# EAGLE design BD3721X_DUAL (EAGLE 8.7.0)
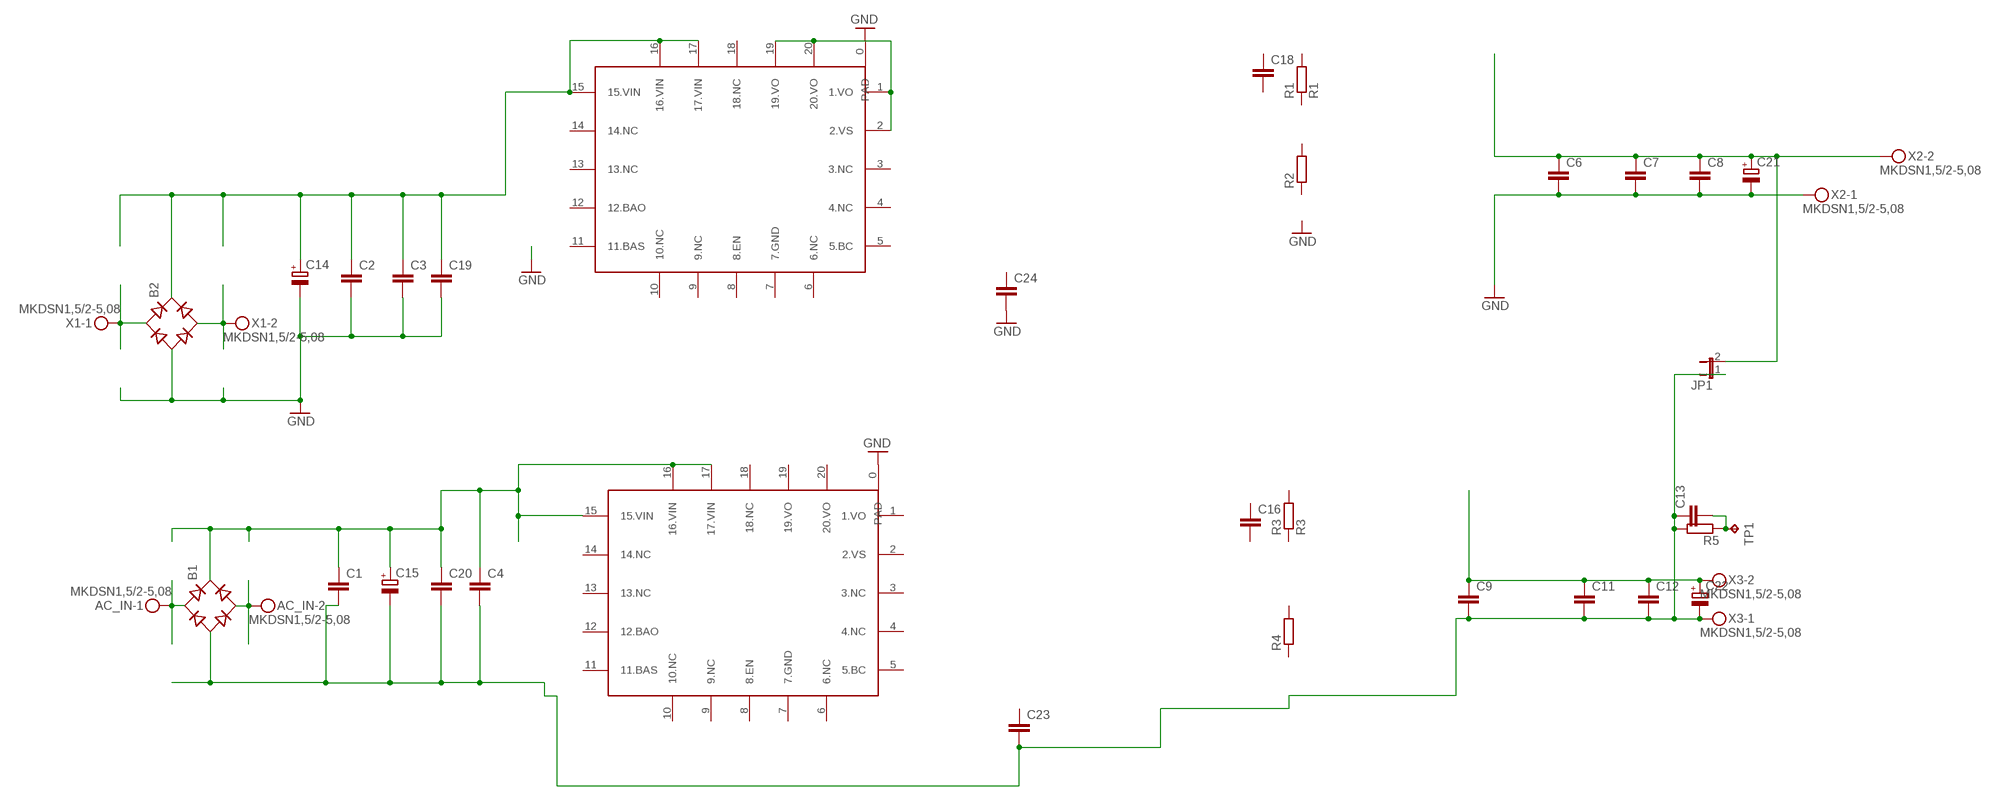
[diagram p0: schematic, sheet 1]

## Parts
AC_IN  MKDSN1,5/2-5,08  [MKDSN1,5/2-5,08]
B1  RB1A  [RB1A]
B2  RB1A  [RB1A]
C1  C-EUC1210  [C1210]
C2  C-EUC1210  [C1210]
C3  C-EUC0805  [C0805]
C4  C-EUC0805  [C0805]
C6  C-EUC0603  [C0603]
C7  C-EUC0805  [C0805]
C8  C-EUC1210  [C1210]
C9  C-EUC0603  [C0603]
C11  C-EUC1210  [C1210]
C12  C-EUC0805  [C0805]
C13  C-EU075-042X103  [C075-042X103]
C14  CPOL-EUE5-13  [E5-13]
C15  CPOL-EUE5-13  [E5-13]
C16  C-EUC0603  [C0603]
C18  C-EUC0603  [C0603]
C19  C-EUC0603  [C0603]
C20  C-EUC0603  [C0603]
C21  CPOL-EUE3.5-8  [E3,5-8]
C22  CPOL-EUE3.5-8  [E3,5-8]
C23  C-EUC0603  [C0603]
C24  C-EUC0603  [C0603]
JP1  JP1E  [JP1]
R1  R1  R-EU_R0805  [R0805]
R2  R-EU_R0805  [R0805]
R3  R3  R-EU_R0805  [R0805]
R4  R-EU_R0805  [R0805]
R5  R-EU_0207/12  [0207/12]
TP1  TPPAD1-13  [P1-13]
U$1  BD37210QFN20  [QFN20-4X4MM]
U$2  BD37210QFN20  [QFN20-4X4MM]
X1  MKDSN1,5/2-5,08  [MKDSN1,5/2-5,08]
X2  MKDSN1,5/2-5,08  [MKDSN1,5/2-5,08]
X3  MKDSN1,5/2-5,08  [MKDSN1,5/2-5,08]

## Nets
GND: B2.- C2.2 C3.2 C6.2 C7.2 C8.2 C14.- C19.2 C21.- C24.2 U$1.0(PAD) U$2.0(PAD) X2.1
GND2: B1.- C1.2 C4.2 C9.2 C11.2 C12.2 C13.1 C15.- C20.2 C22.- C23.2 JP1.1 R5.2 X3.1
N$2: AC_IN.1 B1.AC1
N$3: B2.+ C2.1 C3.1 C14.+ C19.1 U$1.15(15.VIN) U$1.16(16.VIN) U$1.17(17.VIN)
N$5: U$1.1(1.VO) U$1.2(2.VS) U$1.19(19.VO) U$1.20(20.VO)
N$9: B2.AC2 X1.2
N$10: B2.AC1 X1.1
N$12: AC_IN.2 B1.AC2
N$13: C13.2 R5.1 TP1.TP
N$15: B1.+ C1.1 C4.1 C15.+ C20.1 U$2.15(15.VIN) U$2.16(16.VIN) U$2.17(17.VIN)
V+: C6.1 C7.1 C8.1 C21.+ JP1.2 X2.2
V-: C9.1 C11.1 C12.1 C22.+ X3.2
Unconnected: C16.1 C16.2 C18.1 C18.2 C23.1 C24.1 R1.1 R1.2 R2.1 R2.2 R3.1 R3.2 R4.1 R4.2 U$1.3(3.NC) U$1.4(4.NC) U$1.5(5.BC) U$1.6(6.NC) U$1.7(7.GND) U$1.8(8.EN) U$1.9(9.NC) U$1.10(10.NC) U$1.11(11.BAS) U$1.12(12.BAO) U$1.13(13.NC) U$1.14(14.NC) U$1.18(18.NC) U$2.1(1.VO) U$2.2(2.VS) U$2.3(3.NC) U$2.4(4.NC) U$2.5(5.BC) U$2.6(6.NC) U$2.7(7.GND) U$2.8(8.EN) U$2.9(9.NC) U$2.10(10.NC) U$2.11(11.BAS) U$2.12(12.BAO) U$2.13(13.NC) U$2.14(14.NC) U$2.18(18.NC) U$2.19(19.VO) U$2.20(20.VO)

## Library data of the parts
AC_IN X1-X3 = con-phoenix-508:MKDSN1,5/2-5,08: MKDSN 1,5/ 2-5,08 Printklemme Nennstrom: 13,5 A Nennspannung: 250 V Rastermaß: 5,08 mm Polzahl: 2 Anschlussart: Schraubanschluss Montage: Löten Anschlussrichtung Leiter/Platine: 0 ° Artikelnummer: 1729128 Source: http://eshop.phoenixcontact.com .. 1729128.pdf
B1 B2 = rectifier:RB1A: RECTIFIER 1 A
C1-C4 C6-C9 C11-C13 C16 C18-C20 C23 C24 = Vwvwbg:C-EU: CAPACITOR, European symbol
C14 C15 C21 C22 = Vwvwbg:CPOL-EU: POLARIZED CAPACITOR, European symbol
JP1 = jumper:JP1E: JUMPER
R1-R5 = Vwvwbg:R-EU_: RESISTOR, European symbol
TP1 = testpad:TP: Test pad
U$1 U$2 = Vwvwbg:BD37210

## Board
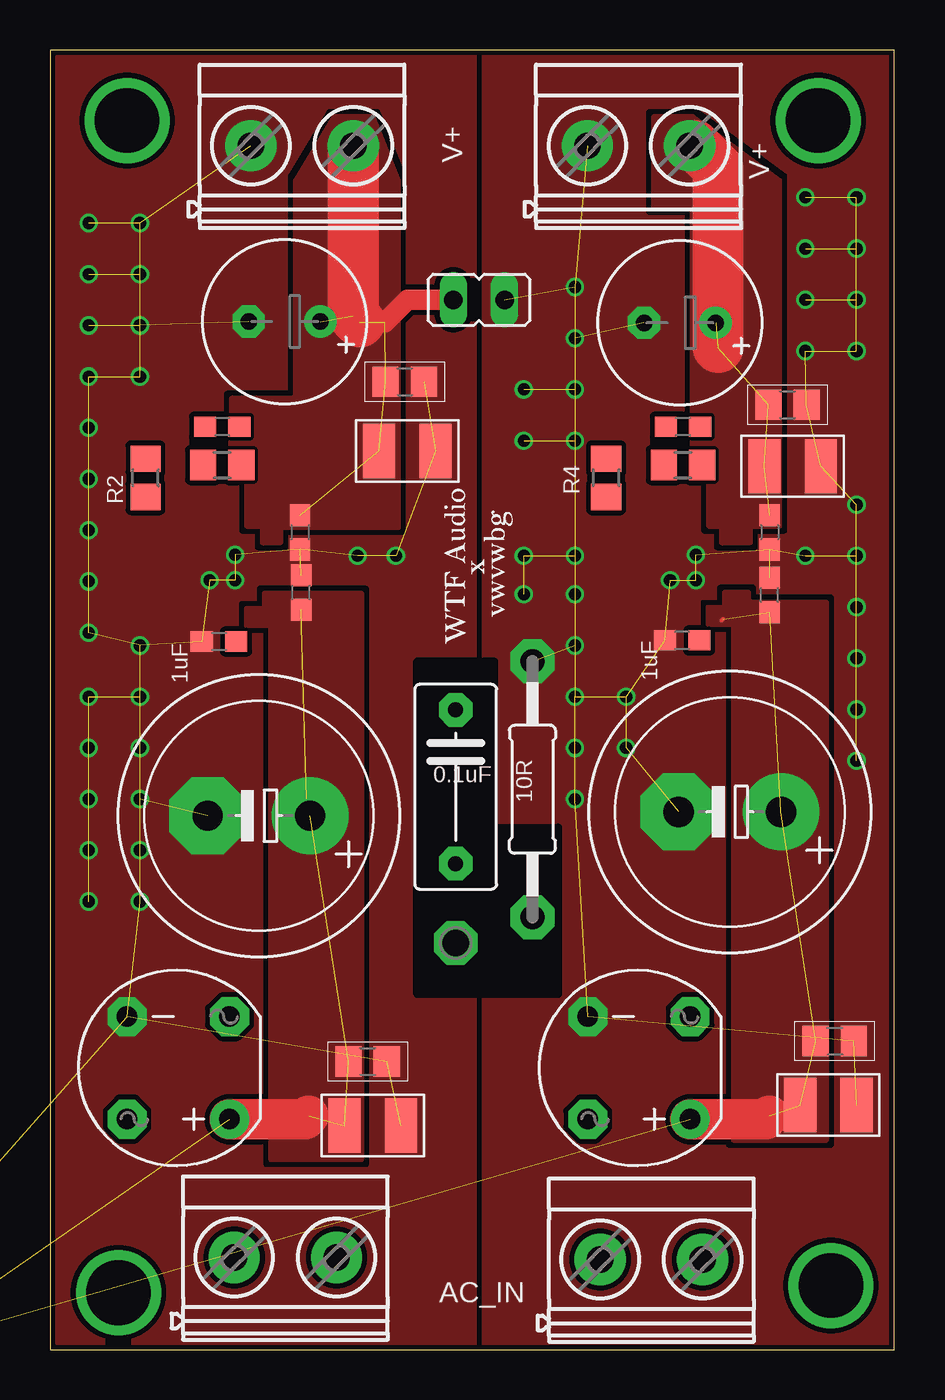
[diagram p1: board, top side]
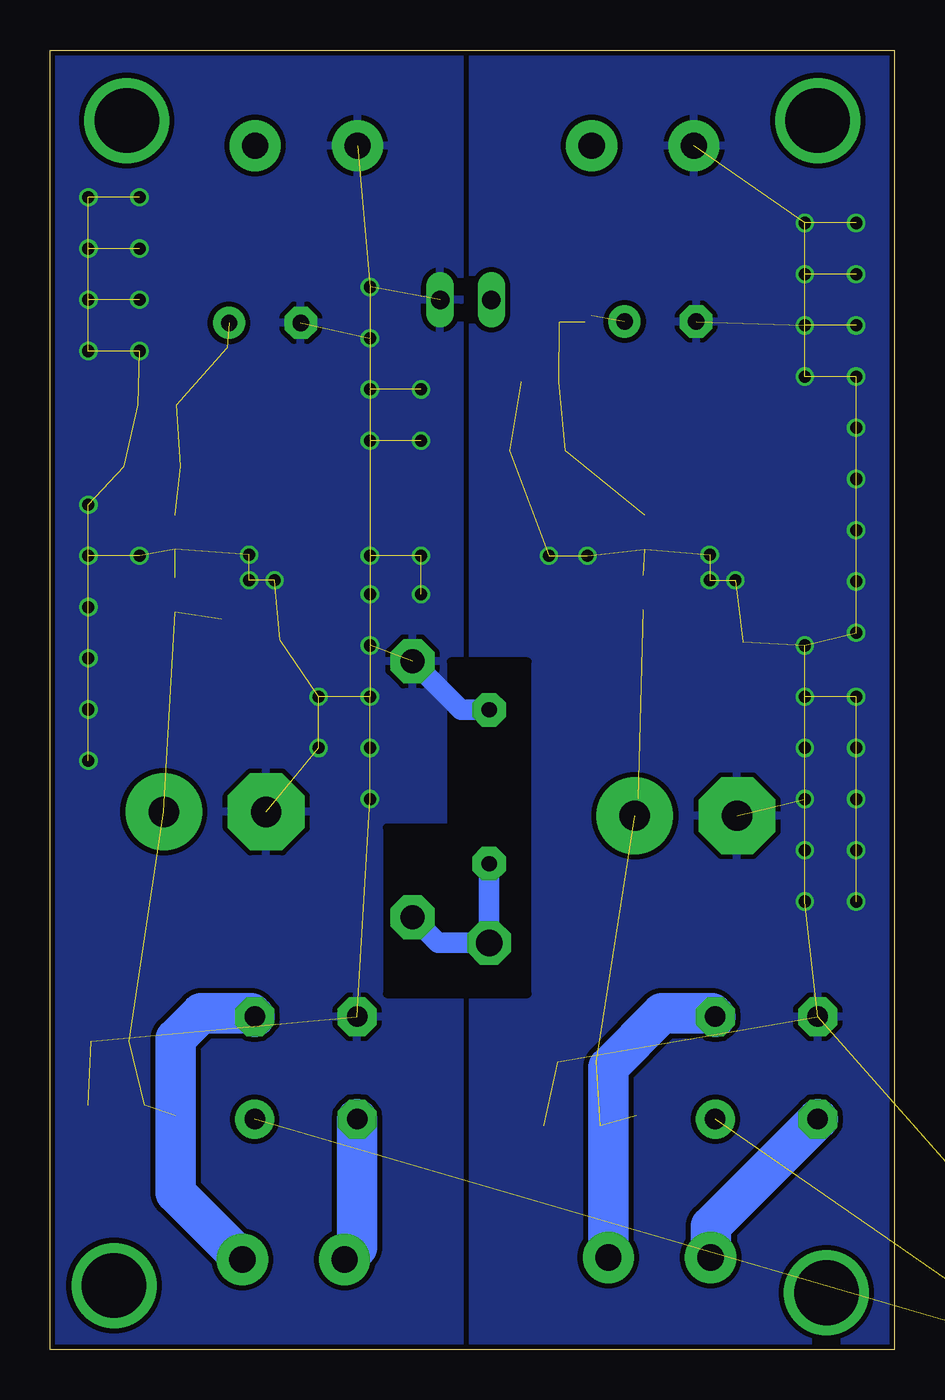
[diagram p2: board, bottom side, seen from below]

Size 41.89 x 64.44 mm. Coordinates in mm from the lower left corner, seen from the top.
Outline: 0,0 41.89,0 41.89,64.44 0,64.44 0,0
Copper layers (1*16): Top 0.035mm / dielectric 1.5mm / Bottom 0.035mm
Design rules "default *": minimum track width 6mil, minimum drill 0.3mm, track to track 7mil, track to pad 7mil, pad to pad 7mil, via to via 7mil, smd to smd 7mil, copper to edge 8mil, drill to drill 8mil, minimum pad ring 6mil, minimum via ring 6mil, stop-mask expansion 4mil, vias tented up to drill 25mil, thermal gap 10mil

### Footprints (pad centres in the part's own frame; a part is rotated, then mirrored left to right if it is on the bottom)
MKDSN1,5/2-5,08 = drill 1.3 pad 2.54: 1 -2.561,0.025; 2 2.519,0.025
RB1A = drill 1.016 pad 1.93: + -2.54,2.54 | drill 1.016 pad 1.93 octagon: - 2.54,-2.54; AC1 2.54,2.54; AC2 -2.54,-2.54
C1210 = smd 1.6 x 2.7: 1 -1.4,0; 2 1.4,0
C0805 = smd 1.3 x 1.5: 1 -0.95,0; 2 0.95,0
C0603 = smd 1.1 x 1: 1 -0.85,0; 2 0.85,0
C075-042X103 = drill 0.75 pad 1.676 octagon: 1 -3.81,0; 2 3.81,0
E5-13 = drill 1.5 pad 3.81: + -2.54,0 | drill 1.5 pad 3.81 octagon: - 2.54,0
E3,5-8 = drill 0.813 pad 1.6: + -1.778,0 | drill 0.813 pad 1.6 octagon: - 1.778,0
JP1 = drill 0.914 long: 1 0,-1.27; 2 0,1.27
R0805 = smd 1.3 x 1.5: 1 -0.95,0; 2 0.95,0
0207/12 = drill 1.2 pad 2.184 octagon: 1 -6.35,0; 2 6.35,0
P1-13 = drill 1.321 pad 2.159 octagon: TP 0,0
QFN20-4X4MM = smd 1 x 1: 0 0,0 | smd 0.65 x 0.3: 1 -1.9,1; 2 -1.9,0.5; 3 -1.9,0; 4 -1.9,-0.5; 5 -1.9,-1; 11 1.9,-1; 12 1.9,-0.5; 13 1.9,0; 14 1.9,0.5; 15 1.9,1 | smd 0.3 x 0.65: 6 -1,-1.9; 7 -0.5,-1.9; 8 0,-1.9; 9 0.5,-1.9; 10 1,-1.9; 16 1,1.9; 17 0.5,1.9; 18 0,1.9; 19 -0.5,1.9; 20 -1,1.9

### Placement (x,y rotation side)
AC_IN  29.84,4.44 0 top
B1  29.21,13.97 180 top
B2  6.35,13.97 180 top
C1  38.61,12.13 0 top
C2  16,11.11 0 top
C3  15.75,14.29 0 top
C4  38.93,15.3 0 top
C6  12.39,40.54 270 top
C7  17.59,48.01 0 top
C8  17.72,44.58 0 top
C9  35.69,40.54 270 top
C11  36.83,43.81 0 top
C12  36.58,46.86 0 top
C13  20.11,27.92 270 top
C14  10.35,26.48 180 top
C15  33.72,26.67 180 top
C16  31.39,45.78 180 top
C18  8.53,45.78 180 top
C19  12.45,37.55 90 top
C20  35.69,37.43 90 top
C21  11.62,50.99 180 top
C22  31.24,50.93 180 top
C23  31.35,35.18 180 top
C24  8.37,35.12 180 top
JP1  21.27,52.07 90 top
R1  8.53,43.87 0 top
R2  4.72,43.24 90 top
R3  31.39,43.87 0 top
R4  27.58,43.24 90 top
R5  23.92,27.79 90 top
TP1  20.11,20.17 0 top
U$1  -15.13,-4.91 0 top  (outside the outline)
U$2  -22.75,-4.91 0 top  (outside the outline)
X1  11.68,4.55 0 top
X2  12.51,59.69 0 top
X3  29.21,59.69 0 top

### Tracks (layer width: path | path; a pad name or v marks a point on that pad's centre or on a via)
GND  (via drill 0.6)  (41 unrouted)
  other vias: 7.9,38.16 9.17,38.16 1.91,38.1 1.91,27.3 1.91,32.38 1.91,29.85 1.91,24.77 17.14,39.37 1.91,40.64 15.24,39.37 1.91,43.18 9.17,39.43 1.91,45.72 1.91,48.26 4.44,48.26 4.44,50.8 1.91,50.8 1.91,53.34 4.44,53.34 4.44,55.88 1.91,55.88 1.91,35.56 1.91,22.23 4.44,22.23 4.44,24.77 4.44,27.3 4.44,29.85 4.44,32.38 4.44,34.92
  pour Top (isolate 0.254, rank 3, no thermals): -1.27,64.77 20.96,64.77 20.96,0 -1.27,0
  pour Bottom (isolate 0.254, rank 3): -1.27,64.77 20.96,64.77 20.96,0 -1.27,0
GND2  (via drill 0.6)  (46 unrouted)
  Bottom 1.016: C13.1 21.51,31.73 R5.2
  other vias: 30.76,38.16 32.03,38.16 40,36.83 40,39.37 37.46,39.37 26.04,37.46 26.04,45.08 23.5,45.08 23.5,47.62 26.04,47.62 32.03,39.43 26.04,39.37 23.5,39.37 23.5,37.46 26.04,34.92 26.04,32.38 26.04,29.85 26.04,27.3 28.57,29.85 28.57,32.38 40,34.29 40,31.75 40,29.21 40,41.91 40,49.53 37.46,49.53 37.46,52.07 40,52.07 40,54.61 37.46,54.61 37.46,57.15 40,57.15 26.04,50.16 26.04,52.7
  pour Bottom (isolate 0.254, rank 2): 21.59,-1.27 44.45,-1.27 44.45,66.04 21.59,66.04
  pour Top (isolate 0.254, rank 2, no thermals): 21.59,-1.27 44.45,-1.27 44.45,66.04 21.59,66.04
N$1  (via drill 3.2)
  other vias: 38.73,3.17
N$2
  Bottom 2: B1.AC1 26.67,5.08 AC_IN.1
N$3  (7 unrouted)
  Top 2: 12.71,27.31 C14.+ | B2.+ 12.64,11.43 12.81,11.6
  pour Top (no thermals): 9.76,35.92 9.76,36.74 10.65,36.74 10.65,37.51 15.41,37.51 15.41,9.44 10.97,9.44 10.98,35.92
N$4  (via drill 3.2)
  other vias: 3.38,2.82
N$5  (3 unrouted)
N$8  (via drill 3.2)
  other vias: 3.81,60.96
N$9
  Bottom 2: X1.2 14.2,14.02 11.54,16.68 9.06,16.68 B2.AC2
N$10
  Bottom 2: X1.1 9.12,6.12 B2.AC1
N$11  (via drill 3.2)
  other vias: 38.1,60.96
N$12
  Bottom 2: AC_IN.2 32.36,4.48 35.67,7.79 35.67,15.41 34.4,16.68 31.92,16.68 B1.AC2
N$13
  Bottom 1.016: C13.2 TP1.TP 22.65,20.17 R5.1
N$14
  cutout Top: 18.21,34.14 22.02,34.14 22.02,25.89 25.19,25.89 25.19,17.63 18.21,17.63
N$15  (8 unrouted)
  Top 0.203: 33.32,36.17 33.38,36.24
  Top 2: B1.+ 35.5,11.43 35.67,11.6
  pour Top (no thermals): 32.62,36.81 32.62,35.98 33.89,35.98 33.89,10.39 38.53,10.39 38.53,37.06 34.65,37.06 34.65,37.56 33.45,37.56 33.45,36.81
N$18
  cutout Bottom: 18.21,34.14 22.02,34.14 22.02,25.89 25.19,25.89 25.19,17.63 18.21,17.63
V+  (5 unrouted)
  Top 1.016: JP1.2 17.72,52.07 16.62,50.97
  Top 2.54: X2.2 15.03,51.29 15.35,50.97
  pour Top (no thermals): 10.52,40.05 11.41,40.05 11.41,40.81 17.26,40.81 17.26,57.95 15.99,61.13 14.08,61.13 12.18,57.95 12.18,47.16 9,47.16 8.94,43.73 9.76,42.9 9.76,40.87 10.52,40.87
V-  (4 unrouted)
  Top 2.54: X3.2 32,59.71 33.13,58.59 33.13,49.7
  pour Top (no thermals): 33.32,40.05 34.72,40.05 34.72,40.87 36.18,40.87 36.18,57.95 31.86,61.13 29.96,61.13 29.96,56.68 31.86,56.68 31.86,44.68 32.69,43.86 32.69,40.87 33.32,40.87

### Text on the board
tPlace: 1uF | 1uF | 0.1uF | 10R | AC_IN
tNames: V+ | V+